# Altium schematic sheet DCAC_V2.SchDoc (part 1 of 3)
size A2; SheetNumber: 4; SheetTotal: 4
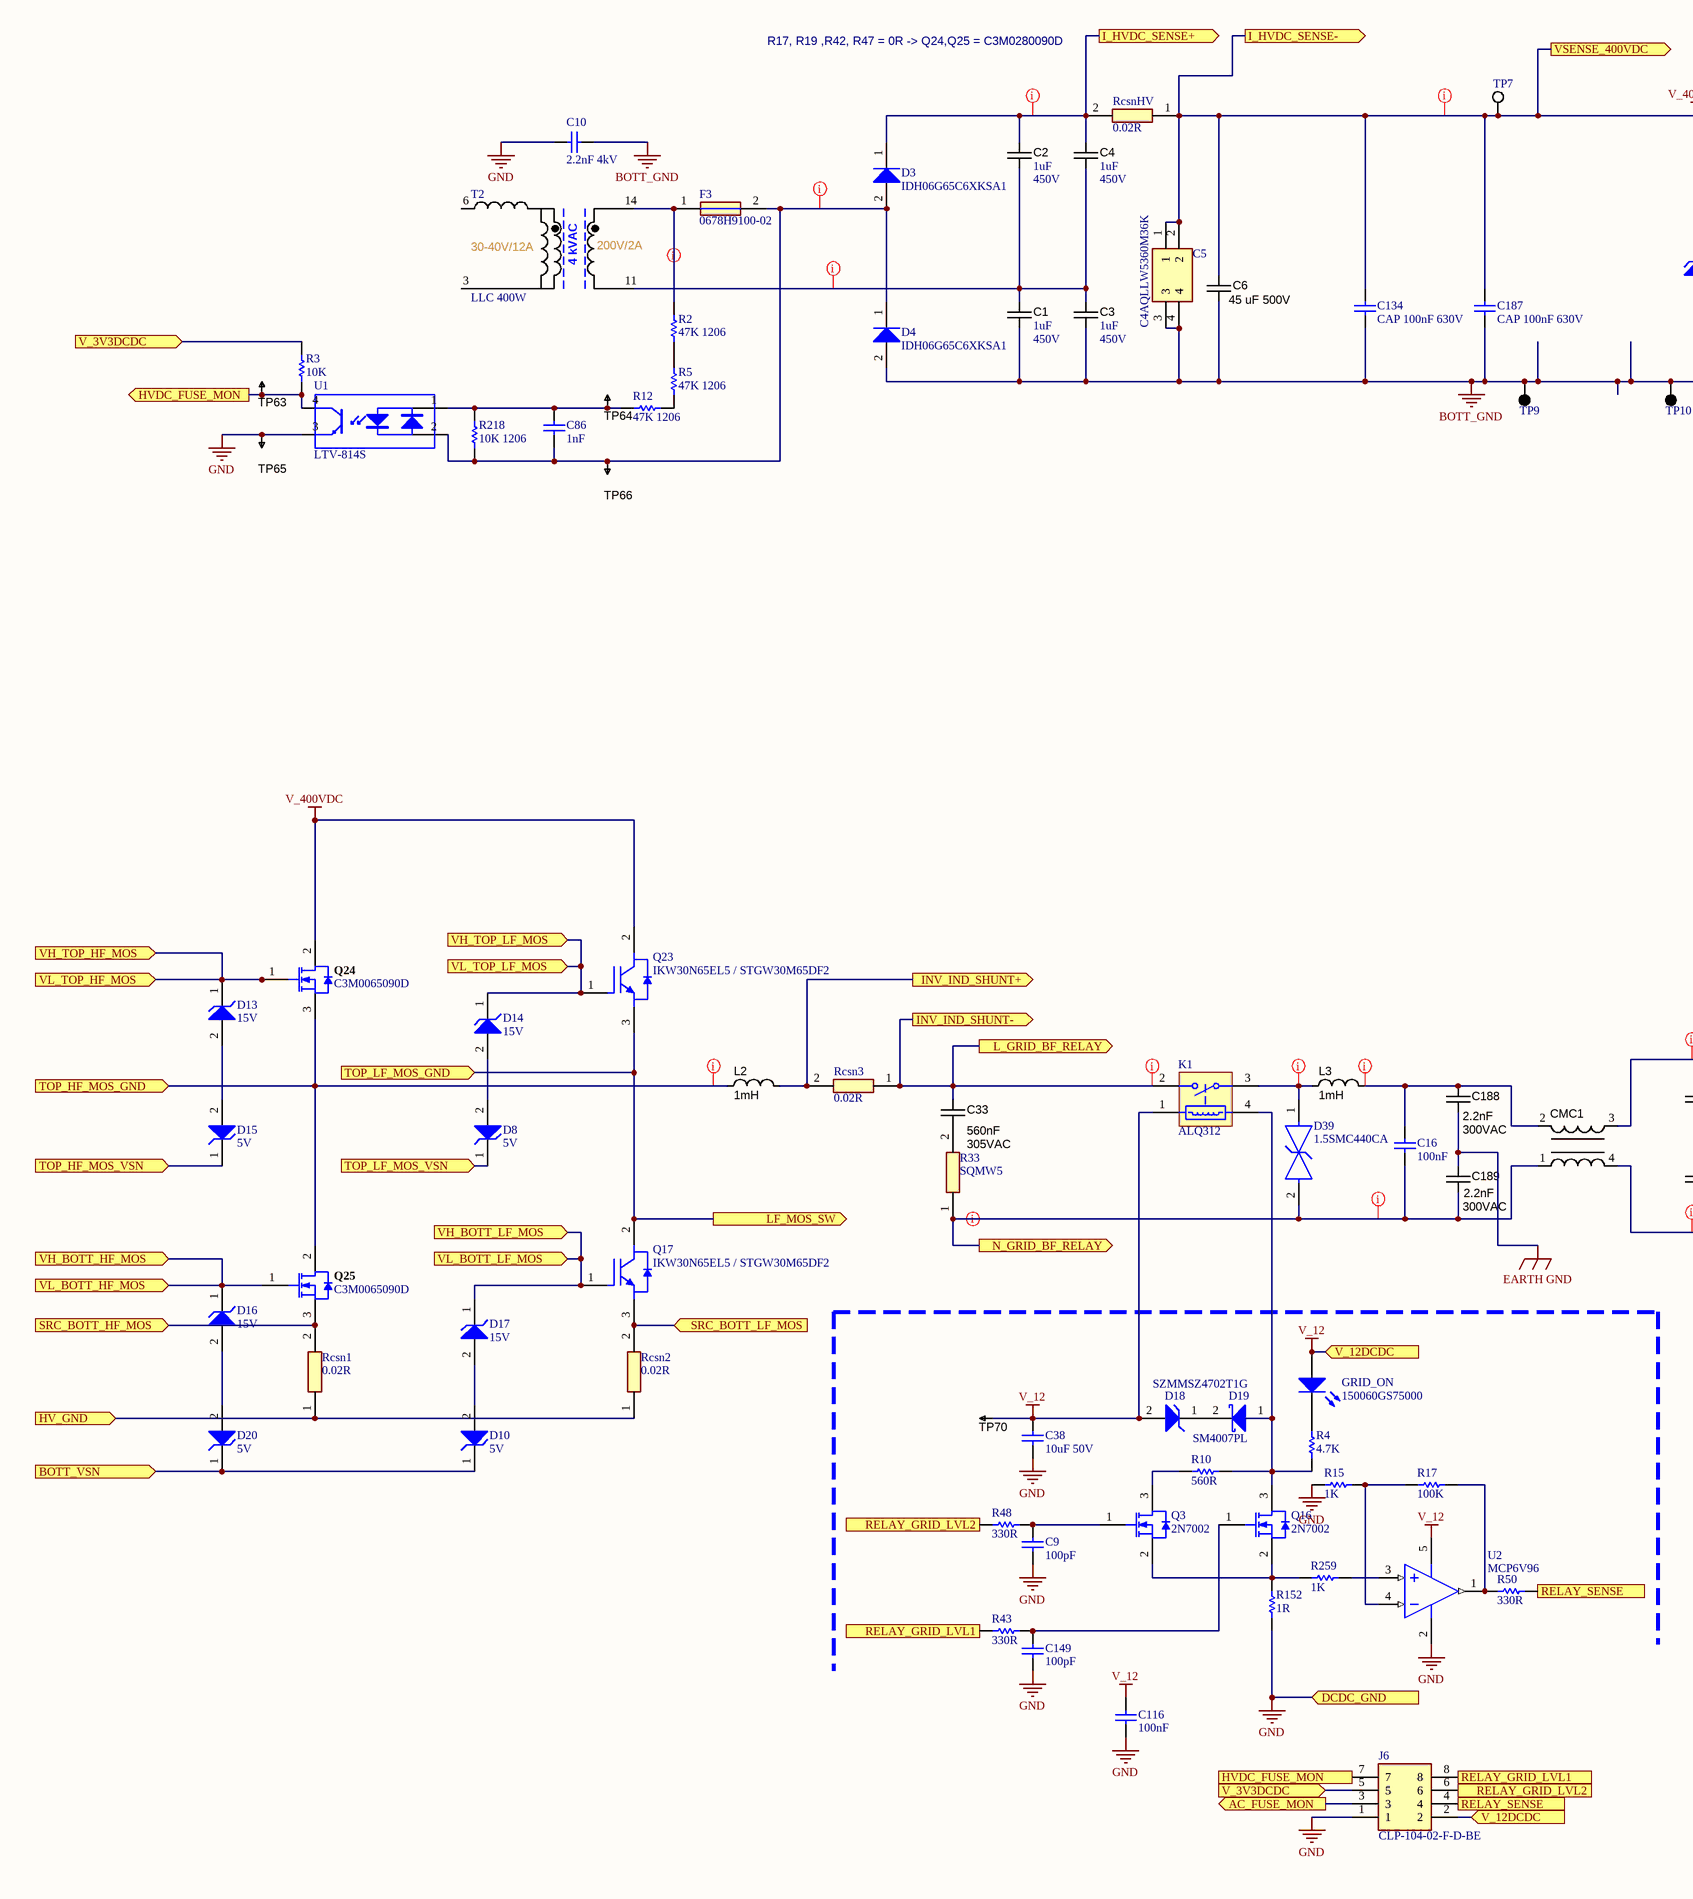
[diagram p0: DCAC_V2.SchDoc, left]
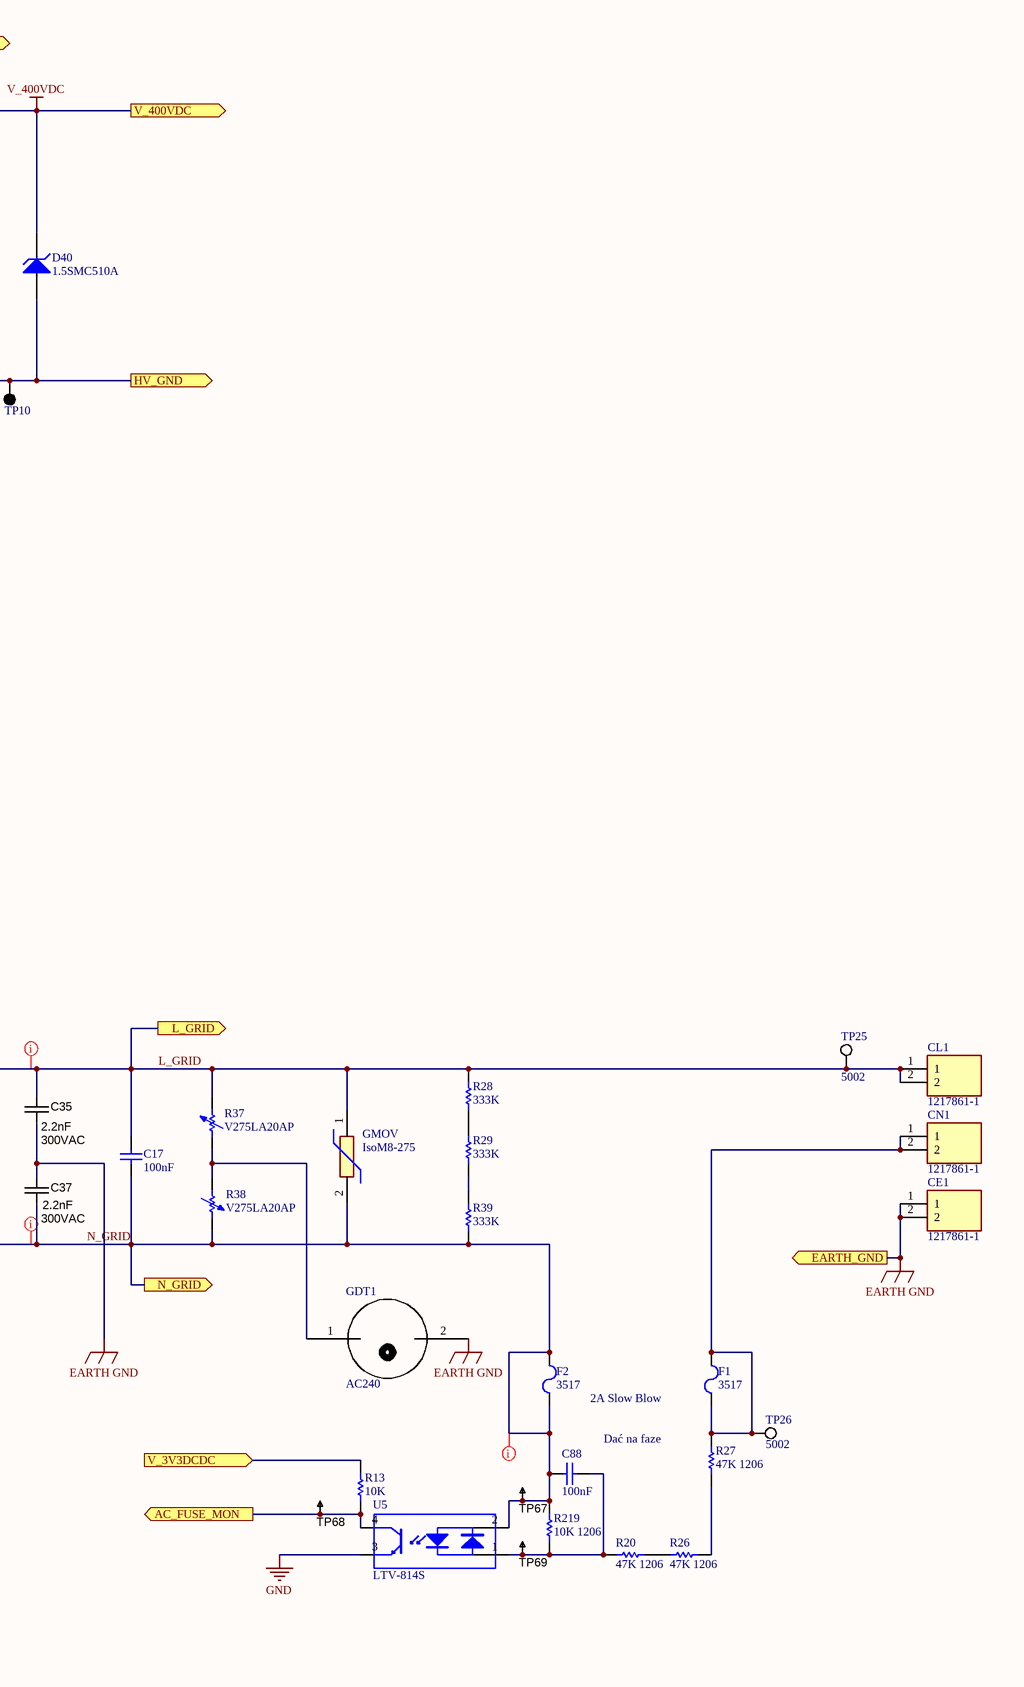
[diagram p1: DCAC_V2.SchDoc, right]

## Parts
C1  Voltage Rating (DC): 450V  [ECW-FE2W105K]  (hidden comment: 1uF)
C2  Voltage Rating (DC): 450V  [ECW-FE2W105K]  (hidden comment: 1uF)
C3  Voltage Rating (DC): 450V  [ECW-FE2W105K]  (hidden comment: 1uF)
C4  Voltage Rating (DC): 450V  [ECW-FE2W105K]  (hidden comment: 1uF)
C5  C4AQLLW5360M36K  [C4AQLLW5360M36K]
C6  45 uF 500V  [C4AQLLW5450A38K]
C9  100pF  [CAPC1608X90X35NL10T15]
C10  2.2nF 4kV  [CAPC5750X279X64LL40T39]
C16  100nF  [TDK-B32922C3104K]
C17  100nF  [TDK-B32922C3104K]
C33  Ratings: 305VAC  [R533I356050P0K]  (hidden comment: 560nF)
C35  Ratings: 300VAC  [CAPMF13.0x5.0x11.0x10.0mm LxWxHxP]  (hidden comment: 2.2nF)
C37  Ratings: 300VAC  [CAPMF13.0x5.0x11.0x10.0mm LxWxHxP]  (hidden comment: 2.2nF)
C38  10uF 50V  [CAPC3216X229X50NL20T25]
C86  1nF  [CAPC1608X90X35NL15T15]
C88  100nF  [CAPC1608X90X35NL10T15]
C116  100nF  [CAPC1608X90X35NL10T15]
C134  CAP 100nF 630V  [CAPC4532X280N]
C149  100pF  [CAPC1608X90X35NL10T15]
C187  CAP 100nF 630V  [CAPC4532X280N]
C188  Ratings: 300VAC  [CAPMF13.0x5.0x11.0x10.0mm LxWxHxP]  (hidden comment: 2.2nF)
C189  Ratings: 300VAC  [CAPMF13.0x5.0x11.0x10.0mm LxWxHxP]  (hidden comment: 2.2nF)
CE1  1217861-1  [1217861-1]
CL1  1217861-1  [1217861-1]
CMC1  (no value)  [DTS-20/0,47/7,0]
CN1  1217861-1  [1217861-1]
D3  IDH06G65C6XKSA1  [INF-PG-TO220-2-1]
D4  IDH06G65C6XKSA1  [INF-PG-TO220-2-1]
D8  5V  [ONSC-SOD-523-2-502-01_V]
D10  5V  [ONSC-SOD-523-2-502-01_V]
D13  15V  [ONSC-SOD-523-2-502-01_V]
D14  15V  [ONSC-SOD-523-2-502-01_V]
D15  5V  [ONSC-SOD-523-2-502-01_V]
D16  15V  [ONSC-SOD-523-2-502-01_V]
D17  15V  [ONSC-SOD-523-2-502-01_V]
D18  SZMMSZ4702T1G  [ONSC-SOD-123-2-425-04_V]
D19  SM4007PL  [DIOD-SOD-123-2_V]
D20  5V  [ONSC-SOD-523-2-502-01_V]
D39  1.5SMC440CA  [FP-1_5SMC-MFG]
D40  1.5SMC510A  [FAIR-DO-214AB-2_V]
F1  3517  [KSTN-3517-2_V]
F2  3517  [KSTN-3517-2_V]
F3  0678H9100-02  [FUSC9830X318N]
GDT1  AC240  [AC240]
GMOV  IsoM8-275  [GMOV20D271K]
GRID_ON  150060GS75000  [0603_A]
J6  CLP-104-02-F-D-BE  [CLP-104-02-XXX-D-BE]
K1  ALQ312  [PNSC-LQ-4-2000x1000x1600_V]
L2  1mH  [PCBComponent_1]
L3  1mH  [PCBComponent_1]
Q3  2N7002  [SOT23-3]
Q16  2N7002  [SOT23-3]
Q17  IKW30N65EL5 / STGW30M65DF2  [INF-PG-TO247-3_V]
Q23  IKW30N65EL5 / STGW30M65DF2  [INF-PG-TO247-3_V]
Q24  C3M0065090D  [CREE-TO-247-3_V]
Q25  C3M0065090D  [CREE-TO-247-3_V]
R2  47K 1206  [RESC3216X70X50NL05T20]
R3  10K  [RESC1609X50X30NL8T20]
R4  4.7K  [RESC1608X55X30NL15T15]
R5  47K 1206  [RESC3216X70X50NL05T20]
R10  560R  [RESC3216X70X40ML20T20]
R12  47K 1206  [RESC3216X70X50NL05T20]
R13  10K  [RESC1609X50X30NL8T20]
R15  1K  [RESC1608X55X30NL15T15]
R17  100K  [RESC1608X55X25NL10T15]
R20  47K 1206  [RESC3216X70X50NL05T20]
R26  47K 1206  [RESC3216X70X50NL05T20]
R27  47K 1206  [RESC3216X70X50NL05T20]
R28  333K  [RESC3216X70X50NL05T20]
R29  333K  [RESC3216X70X50NL05T20]
R33  SQMW5  [SQMW5]
R37  V275LA20AP  [LFUS-V275LA20AP]
R38  V275LA20AP  [LFUS-V275LA20AP]
R39  333K  [RESC3216X70X50NL05T20]
R43  330R  [RESC1608X55X25NL10T15]
R48  330R  [RESC1608X55X25NL10T15]
R50  330R  [RESC1608X55X25NL10T15]
R152  1R  [RESC1608X55X30NL15T15]
R218  10K 1206  [RESC3216X70X50NL05T20]
R219  10K 1206  [RESC3216X70X50NL05T20]
R259  1K  [RESC1608X55X30NL15T15]
Rcsn1  0.02R  [RESC1632X80N]
Rcsn2  0.02R  [RESC1632X80N]
Rcsn3  0.02R  [RESC1632X80N]
RcsnHV  0.02R  [RESC1632X80N]
T2  LLC 400W  [ETD39-K-V-16P-HORIZONTAL-SEC]
TP7  5002  [KSTN-5002]  (value not drawn)
TP9  5001  [KSTN-5001]  (value not drawn)
TP10  5001  [KSTN-5001]  (value not drawn)
TP25  5002  [KSTN-5002]
TP26  5002  [KSTN-5002]
TP63  TESTPOINT  [TP-R60]  (value not drawn)  (no BOM)
TP64  TESTPOINT  [TP-R60]  (value not drawn)  (no BOM)
TP65  TESTPOINT  [TP-R60]  (value not drawn)  (no BOM)
TP66  TESTPOINT  [TP-R60]  (value not drawn)  (no BOM)
TP67  TESTPOINT  [TP-R60]  (value not drawn)  (no BOM)
TP68  TESTPOINT  [TP-R60]  (value not drawn)  (no BOM)
TP69  TESTPOINT  [TP-R60]  (value not drawn)  (no BOM)
TP70  TESTPOINT  [TP-R60]  (value not drawn)  (no BOM)
U1  LTV-814S  [LTV-814S]
U2  MCP6V96  [SOT23-5]
U5  LTV-814S  [LTV-814S]

## Ports
AC_FUSE_MON (out), BOTT_VSN (in), DCDC_GND (in), EARTH_GND (out), HV_GND (in), HV_GND (out), HVDC_FUSE_MON (out), I_HVDC_SENSE+ (out), I_HVDC_SENSE- (out), INV_IND_SHUNT+ (out), INV_IND_SHUNT- (out), L_GRID (out), L_GRID_BF_RELAY (out), LF_MOS_SW (out), N_GRID (out), N_GRID_BF_RELAY (out), RELAY_GRID_LVL1 (in), RELAY_GRID_LVL1 (out), RELAY_GRID_LVL2 (in), RELAY_GRID_LVL2 (out), RELAY_SENSE (in), RELAY_SENSE (out), SRC_BOTT_HF_MOS (in), SRC_BOTT_LF_MOS (in), TOP_HF_MOS_GND (in), TOP_HF_MOS_VSN (in), TOP_LF_MOS_GND (in), TOP_LF_MOS_VSN (in), V_3V3DCDC (in), V_12DCDC (in), V_400VDC (out), VH_BOTT_HF_MOS (in), VH_BOTT_LF_MOS (in), VH_TOP_HF_MOS (in), VH_TOP_LF_MOS (in), VL_BOTT_HF_MOS (in), VL_BOTT_LF_MOS (in), VL_TOP_HF_MOS (in), VL_TOP_LF_MOS (in), VSENSE_400VDC (out)

## Nets
BOTT_GND: C1.2 C3.2 C5.3 C5.4 C6.2 C10.2 C134.1 C187.1 D4.2(A) D40.1(A) Rcsn1.1 Rcsn2.1 TP9.1 TP10.1 ; port HV_GND
EARTH GND: C35.1 C37.2 C188.1 C189.2 CE1.1 CE1.2 GDT1.2 ; port EARTH_GND
GND: C9.1 C10.1 C38.1 C116.1 C149.1 J6.1 R15.2 R152.1 TP65.1 U1.3(EMITTER) U2.2(VSS) U5.3(EMITTER) ; port DCDC_GND
V_12: C38.2 C116.2 D18.2(A) GRID_ON.2(A) J6.2 K1.1 TP70.1 U2.5(VDD) ; port V_12DCDC
V_400VDC: C5.1 C5.2 C6.1 C134.2 C187.2 D40.2(K) Q23.2(C) Q24.2(D) RcsnHV.1 TP7.1 ; port V_400VDC, port VSENSE_400VDC, port I_HVDC_SENSE-
AC_FUSE_MON: J6.3 R13.1 TP68.1 U5.4(COLLECTOR) ; port AC_FUSE_MON
BOTT_VSN: D10.1(K) D20.1(K) ; port BOTT_VSN
HVDC_FUSE_MON: J6.7 R3.1 TP63.1 U1.4(COLLECTOR) ; port HVDC_FUSE_MON
I_HVDC_SENSE+: C2.1 C4.1 D3.1(K) RcsnHV.2 ; port I_HVDC_SENSE+
INV_IND_SHUNT+: L2.1 Rcsn3.2 ; port INV_IND_SHUNT+
INV_IND_SHUNT-: C33.2 K1.2(NO) Rcsn3.1 ; port L_GRID_BF_RELAY, port INV_IND_SHUNT-
L_GRID: C17.2 C35.2 CL1.1 CL1.2 CMC1.3 GMOV.1 R28.2 R37.2 TP25.1 ; port L_GRID
LF_MOS_SW: Q17.2(C) Q23.3(E) ; port TOP_LF_MOS_GND, port LF_MOS_SW
N_GRID: C17.1 C37.1 C88.2 CMC1.4 F2.1 F2.2 GMOV.2 R38.2 R39.1 R219.2 TP67.1 U5.2(CATHODE) ; port N_GRID
N_GRID_BF_RELAY: C16.1 C189.1 CMC1.1 D39.2 R33.1 ; port N_GRID_BF_RELAY
RELAY_GRID_LVL1: J6.8 R43.2 ; port RELAY_GRID_LVL1
RELAY_GRID_LVL2: J6.6 R48.2 ; port RELAY_GRID_LVL2
RELAY_SENSE: J6.4 R50.1 ; port RELAY_SENSE
SRC_BOTT_HF_MOS: Q25.3(S) Rcsn1.2 ; port SRC_BOTT_HF_MOS
SRC_BOTT_LF_MOS: Q17.3(E) Rcsn2.2 ; port SRC_BOTT_LF_MOS
TOP_HF_MOS_GND: L2.2 Q24.3(S) Q25.2(D) ; port TOP_HF_MOS_GND
TOP_HF_MOS_VSN: D15.1(K) ; port TOP_HF_MOS_VSN
TOP_LF_MOS_VSN: D8.1(K) ; port TOP_LF_MOS_VSN
V_3V3DCDC: J6.5 R3.2 R13.2 ; port V_3V3DCDC
VH_BOTT_HF_MOS: D16.1(K) Q25.1(G) ; port VH_BOTT_HF_MOS, port VL_BOTT_HF_MOS
VH_BOTT_LF_MOS: D17.1(K) Q17.1(G) ; port VH_BOTT_LF_MOS, port VL_BOTT_LF_MOS
VH_TOP_HF_MOS: D13.1(K) Q24.1(G) ; port VH_TOP_HF_MOS, port VL_TOP_HF_MOS
VH_TOP_LF_MOS: D14.1(K) Q23.1(G) ; port VH_TOP_LF_MOS, port VL_TOP_LF_MOS
NetC1_1: C1.1 C2.2 C3.1 C4.2 T2.11
NetC9_2: C9.2 Q3.1(G) R48.1
NetC16_2: C16.2 C188.2 CMC1.2 L3.1
NetC33_1: C33.1 R33.2
NetC86_1: C86.1 D3.2(A) D4.1(K) F3.2 R218.1 TP66.1 U1.2(CATHODE)
NetC86_2: C86.2 R12.1 R218.2 TP64.1 U1.1(ANODE)
NetC88_1: C88.1 R20.1 R219.1 TP69.1 U5.1(ANODE)
NetC149_2: C149.2 Q16.1(G) R43.1
NetCN1_1: CN1.1 CN1.2 F1.1 F1.2 R27.2 TP26.1
NetD8_2: D8.2(A) D14.2(A)
NetD10_2: D10.2(A) D17.2(A)
NetD13_2: D13.2(A) D15.2(A)
NetD16_2: D16.2(A) D20.2(A)
NetD18_1: D18.1(K) D19.2(K)
NetD19_1: D19.1(A) K1.4 Q16.3(D) R4.1 R10.2
NetD39_1: D39.1 K1.3(COM) L3.2
NetF3_1: F3.1 R2.2 T2.14
NetGDT1_1: GDT1.1 R37.1 R38.1
NetGRID_ON_1: GRID_ON.1(K) R4.2
NetQ3_2: Q3.2(S) Q16.2(S) R152.2 R259.2
NetQ3_3: Q3.3(D) R10.1
NetR2_1: R2.1 R5.2
NetR5_1: R5.1 R12.2
NetR15_1: R15.1 R17.2 U2.4(VIN-)
NetR17_1: R17.1 R50.2 U2.1(VOUT)
NetR20_2: R20.2 R26.1
NetR26_2: R26.2 R27.1
NetR28_1: R28.1 R29.2
NetR29_1: R29.1 R39.2
NetR259_1: R259.1 U2.3(VIN+)

Not connected (* = marked no-connect by the designer): T2 3 6

## Layout directives
net class GRID+: INV_IND_SHUNT-, L_GRID, N_GRID, NetD39_1
net class GRID-: N_GRID, N_GRID_BF_RELAY, NetC16_2
net class HVDC+: I_HVDC_SENSE+, NetC1_1, NetC86_1, NetF3_1, TOP_HF_MOS_GND, V_400VDC

## Notes on the sheet
- R17, R19 ,R42, R47 = 0R -> Q24,Q25 = C3M0280090D
- 2A Slow Blow
- Dać na faze
- (in symbol TI-ETD39-200V-2A-LLC) 30-40V/12A; 200V/2A; 4 kVAC